# EasyEDA schematic audio channel.json
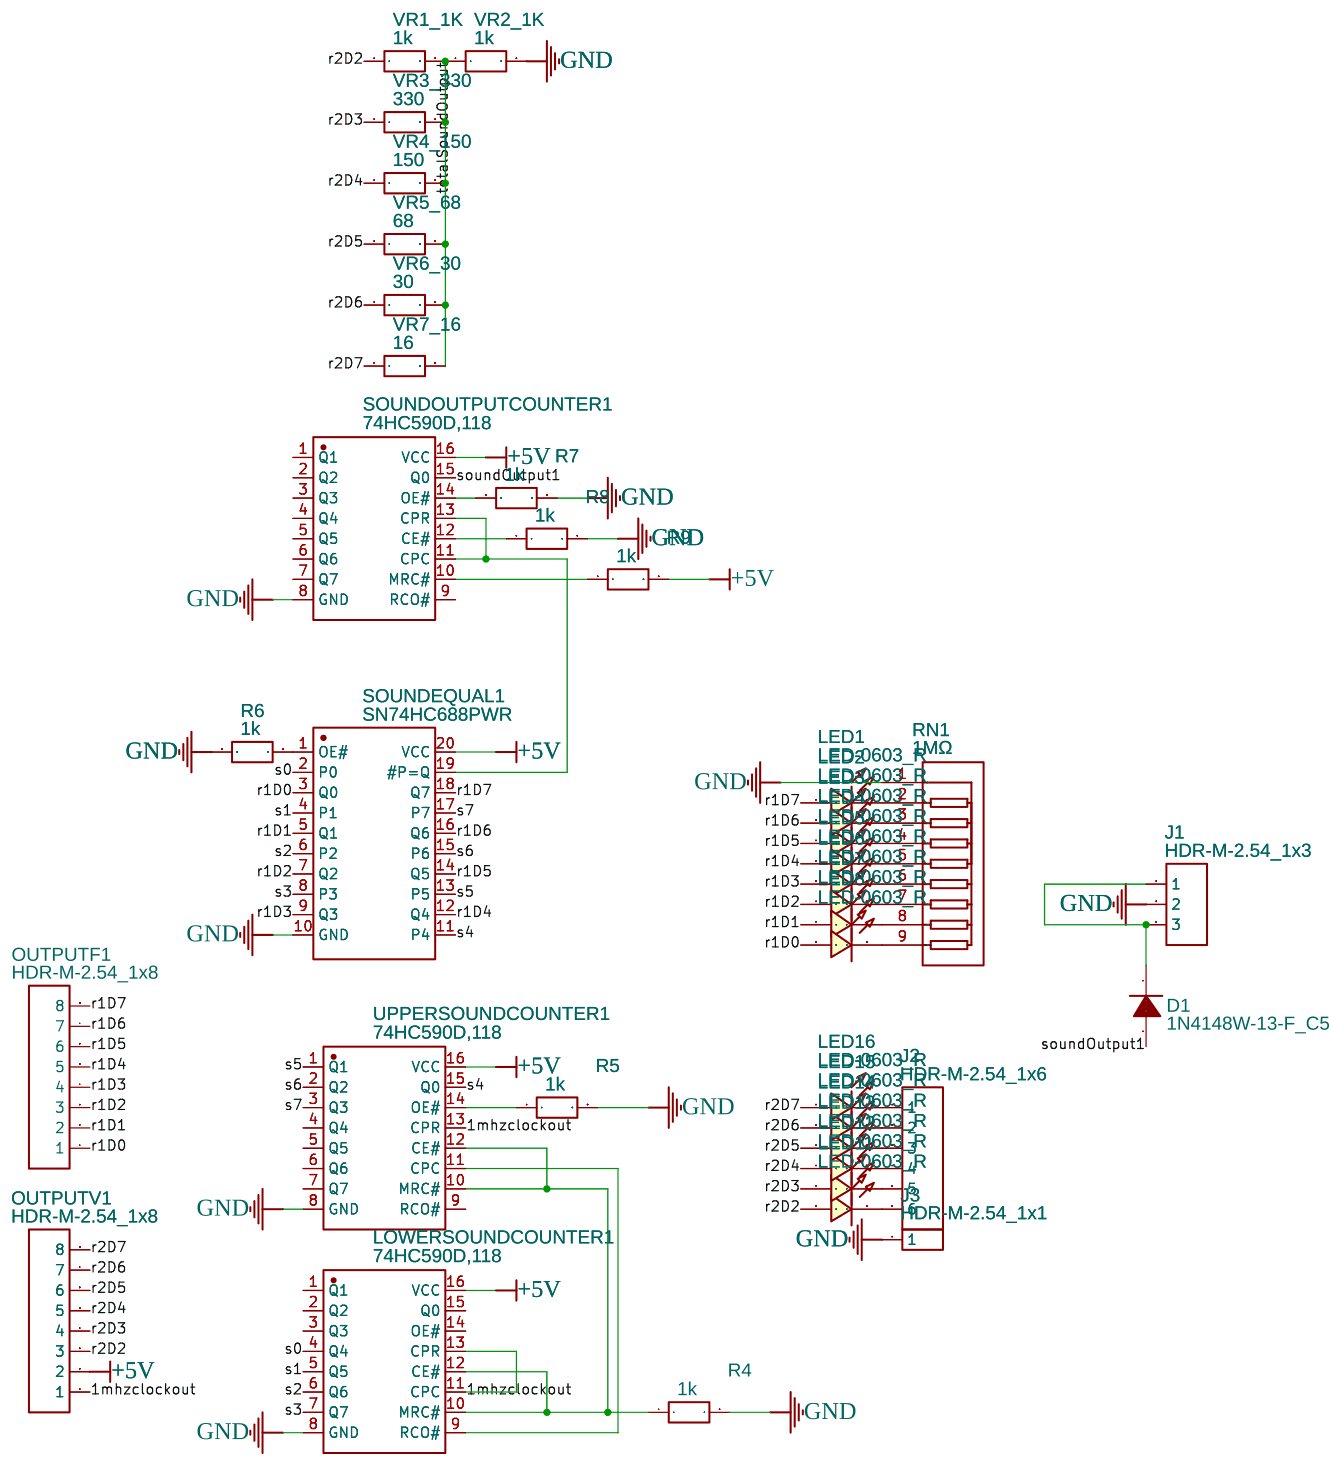
[diagram p0: schematic sheet]

## Parts
D1  1N4148W-13-F_C526199  [SOD-123_L2.7-W1.6-LS3.7-RD]
J1  HDR-M-2.54_1x3  [HDR-M-2.54_1X3]
J2  HDR-M-2.54_1x6  [HDR-M-2.54_1X6]
J3  HDR-M-2.54_1x1  [HDR-M-2.54_1X1]
LED1  LED-0603_R  [LED0603_RED]
LED2  LED-0603_R  [LED0603_RED]
LED3  LED-0603_R  [LED0603_RED]
LED4  LED-0603_R  [LED0603_RED]
LED5  LED-0603_R  [LED0603_RED]
LED6  LED-0603_R  [LED0603_RED]
LED7  LED-0603_R  [LED0603_RED]
LED8  LED-0603_R  [LED0603_RED]
LED11  LED-0603_R  [LED0603_RED]
LED12  LED-0603_R  [LED0603_RED]
LED13  LED-0603_R  [LED0603_RED]
LED14  LED-0603_R  [LED0603_RED]
LED15  LED-0603_R  [LED0603_RED]
LED16  LED-0603_R  [LED0603_RED]
LOWERSOUNDCOUNTER1  74HC590D,118  [SO-16_L9.9-W3.9-P1.27-LS6.0-BL]
OUTPUTF1  HDR-M-2.54_1x8  [HDR-M-2.54_1X8]
OUTPUTV1  HDR-M-2.54_1x8  [HDR-M-2.54_1X8]
R4  1k  [R1206]
R5  1k  [R1206]
R6  1k  [R1206]
R7  1k  [R1206]
R8  1k  [R1206]
R9  1k  [R1206]
RN1  1MΩ  [RES-ARRAY-TH_9P-P2.54-D1.0]
SOUNDEQUAL1  SN74HC688PWR  [TSSOP-20_L6.5-W4.4-P0.65-LS6.4-BL]
SOUNDOUTPUTCOUNTER1  74HC590D,118  [SO-16_L9.9-W3.9-P1.27-LS6.0-BL]
UPPERSOUNDCOUNTER1  74HC590D,118  [SO-16_L9.9-W3.9-P1.27-LS6.0-BL]
VR1_1K  1k  [R1206]
VR2_1K  1k  [R1206]
VR3_330  330  [R1206]
VR4_150  150  [R1206]
VR5_68  68  [R1206]
VR6_30  30  [R1206]
VR7_16  16  [R1206]

## Library data of the parts
D1 = 1N4148W-13-F_C526199: Contributor: LCSC; Supplier: LCSC; Supplier Part: C526199; Manufacturer: Diodes Incorporated
J1 = HDR-M-2.54_1x3: Supplier Part: C180248; Supplier: LCSC; Contributor: LCEDA_Lib
J2 = HDR-M-2.54_1x6: Supplier Part: C190819; Supplier: LCSC; Contributor: LCEDA_Lib
J3 = HDR-M-2.54_1x1: Supplier Part: C81276; Supplier: LCSC; Contributor: LCEDA_Lib
LED1-LED8 LED11-LED16 = LED-0603_R: Manufacturer: EVERLIGHT(台湾亿光); Manufacturer Part: 19-217/R6C-AL1M2VY/3T; Supplier Part: C72044; Supplier: LCSC; Contributor: LCEDA_01
LOWERSOUNDCOUNTER1 SOUNDOUTPUTCOUNTER1 UPPERSOUNDCOUNTER1 = 74HC590D,118: Contributor: LCSC; Supplier: LCSC; Supplier Part: C547118; Manufacturer: Nexperia(安世); JLCPCB Part Class: Extended Part; link: https://lcsc.com/eda_search?q=C547118&%26type=1&ref=editor
OUTPUTF1 OUTPUTV1 = HDR-M-2.54_1x8: Supplier Part: C190820; Supplier: LCSC; Contributor: LCEDA_Lib
R4-R9 VR1_1K VR2_1K VR3_330 VR4_150 VR5_68 VR6_30 VR7_16 = R_1206_EU: Contributor: LCEDA_Lib
RN1 = 4609X-101-105LF: Supplier: LCSC; Supplier Part: C1358086; Manufacturer: BOURNS; JLCPCB Part Class: Extended Part; Contributor: lcsc
SOUNDEQUAL1 = SN74HC688PWR: Contributor: LCSC; Supplier: LCSC; Manufacturer: TI(德州仪器); Supplier Part: C132045; JLCPCB Part Class: Extended Part; link: https://lcsc.com/eda_search?q=C132045&%26type=1&ref=editor

## Nets
+5V: LOWERSOUNDCOUNTER1.16(VCC) OUTPUTV1.2 R9.2 SOUNDEQUAL1.20(VCC) SOUNDOUTPUTCOUNTER1.16(VCC) UPPERSOUNDCOUNTER1.16(VCC)
GND: J1.2 J3.1 LOWERSOUNDCOUNTER1.8(GND) R4.2 R5.2 R6.1 R7.2 R8.2 RN1.1 SOUNDEQUAL1.10(GND) SOUNDOUTPUTCOUNTER1.8(GND) UPPERSOUNDCOUNTER1.8(GND) VR2_1K.2
1mhzclockout: LOWERSOUNDCOUNTER1.11(CPC) LOWERSOUNDCOUNTER1.13(CPR) OUTPUTV1.1 UPPERSOUNDCOUNTER1.13(CPR)
r1D0: LED8.1 OUTPUTF1.1 SOUNDEQUAL1.3(Q0)
r1D1: LED7.1 OUTPUTF1.2 SOUNDEQUAL1.5(Q1)
r1D2: LED6.1 OUTPUTF1.3 SOUNDEQUAL1.7(Q2)
r1D3: LED5.1 OUTPUTF1.4 SOUNDEQUAL1.9(Q3)
r1D4: LED4.1 OUTPUTF1.5 SOUNDEQUAL1.12(Q4)
r1D5: LED3.1 OUTPUTF1.6 SOUNDEQUAL1.14(Q5)
r1D6: LED2.1 OUTPUTF1.7 SOUNDEQUAL1.16(Q6)
r1D7: LED1.1 OUTPUTF1.8 SOUNDEQUAL1.18(Q7)
r2D2: LED11.1 OUTPUTV1.3 VR1_1K.1
r2D3: LED12.1 OUTPUTV1.4 VR3_330.1
r2D4: LED13.1 OUTPUTV1.5 VR4_150.1
r2D5: LED14.1 OUTPUTV1.6 VR5_68.1
r2D6: LED15.1 OUTPUTV1.7 VR6_30.1
r2D7: LED16.1 OUTPUTV1.8 VR7_16.1
s0: LOWERSOUNDCOUNTER1.4(Q4) SOUNDEQUAL1.2(P0)
s1: LOWERSOUNDCOUNTER1.5(Q5) SOUNDEQUAL1.4(P1)
s2: LOWERSOUNDCOUNTER1.6(Q6) SOUNDEQUAL1.6(P2)
s3: LOWERSOUNDCOUNTER1.7(Q7) SOUNDEQUAL1.8(P3)
s4: SOUNDEQUAL1.11(P4) UPPERSOUNDCOUNTER1.15(Q0)
s5: SOUNDEQUAL1.13(P5) UPPERSOUNDCOUNTER1.1(Q1)
s6: SOUNDEQUAL1.15(P6) UPPERSOUNDCOUNTER1.2(Q2)
s7: SOUNDEQUAL1.17(P7) UPPERSOUNDCOUNTER1.3(Q3)
soundOutput1: D1.2(+) SOUNDOUTPUTCOUNTER1.15(Q0)
totalSoundOutput: VR1_1K.2 VR2_1K.1 VR3_330.2 VR4_150.2 VR5_68.2 VR6_30.2 VR7_16.2
Net-(D1-1): D1.1(-) J1.1 J1.3
Net-(J2-1): J2.1 LED16.2
Net-(J2-2): J2.2 LED15.2
Net-(J2-3): J2.3 LED14.2
Net-(J2-4): J2.4 LED13.2
Net-(J2-5): J2.5 LED12.2
Net-(J2-6): J2.6 LED11.2
Net-(LED1-2): LED1.2 RN1.2
Net-(LED2-2): LED2.2 RN1.3
Net-(LED3-2): LED3.2 RN1.4
Net-(LED4-2): LED4.2 RN1.5
Net-(LED5-2): LED5.2 RN1.6
Net-(LED6-2): LED6.2 RN1.7
Net-(LED7-2): LED7.2 RN1.8
Net-(LED8-2): LED8.2 RN1.9
Net-(LOWERSOUNDCOUNTER1-9): LOWERSOUNDCOUNTER1.9(RCO#) UPPERSOUNDCOUNTER1.11(CPC)
Net-(LOWERSOUNDCOUNTER1-10): LOWERSOUNDCOUNTER1.10(MRC#) LOWERSOUNDCOUNTER1.12(CE#) R4.1 UPPERSOUNDCOUNTER1.10(MRC#) UPPERSOUNDCOUNTER1.12(CE#)
Net-(R5-1): R5.1 UPPERSOUNDCOUNTER1.14(OE#)
Net-(R6-2): R6.2 SOUNDEQUAL1.1(OE#)
Net-(R7-1): R7.1 SOUNDOUTPUTCOUNTER1.14(OE#)
Net-(R8-1): R8.1 SOUNDOUTPUTCOUNTER1.12(CE#)
Net-(R9-1): R9.1 SOUNDOUTPUTCOUNTER1.10(MRC#)
Net-(SOUNDEQUAL1-19): SOUNDEQUAL1.19(#P=Q) SOUNDOUTPUTCOUNTER1.11(CPC) SOUNDOUTPUTCOUNTER1.13(CPR)

Not connected (* = marked no-connect by the designer): LOWERSOUNDCOUNTER1 1(Q1) 2(Q2) 3(Q3) 14(OE#) 15(Q0); SOUNDOUTPUTCOUNTER1 1(Q1) 2(Q2) 3(Q3) 4(Q4) 5(Q5) 6(Q6) 7(Q7) 9(RCO#); UPPERSOUNDCOUNTER1 4(Q4) 5(Q5) 6(Q6) 7(Q7) 9(RCO#)
